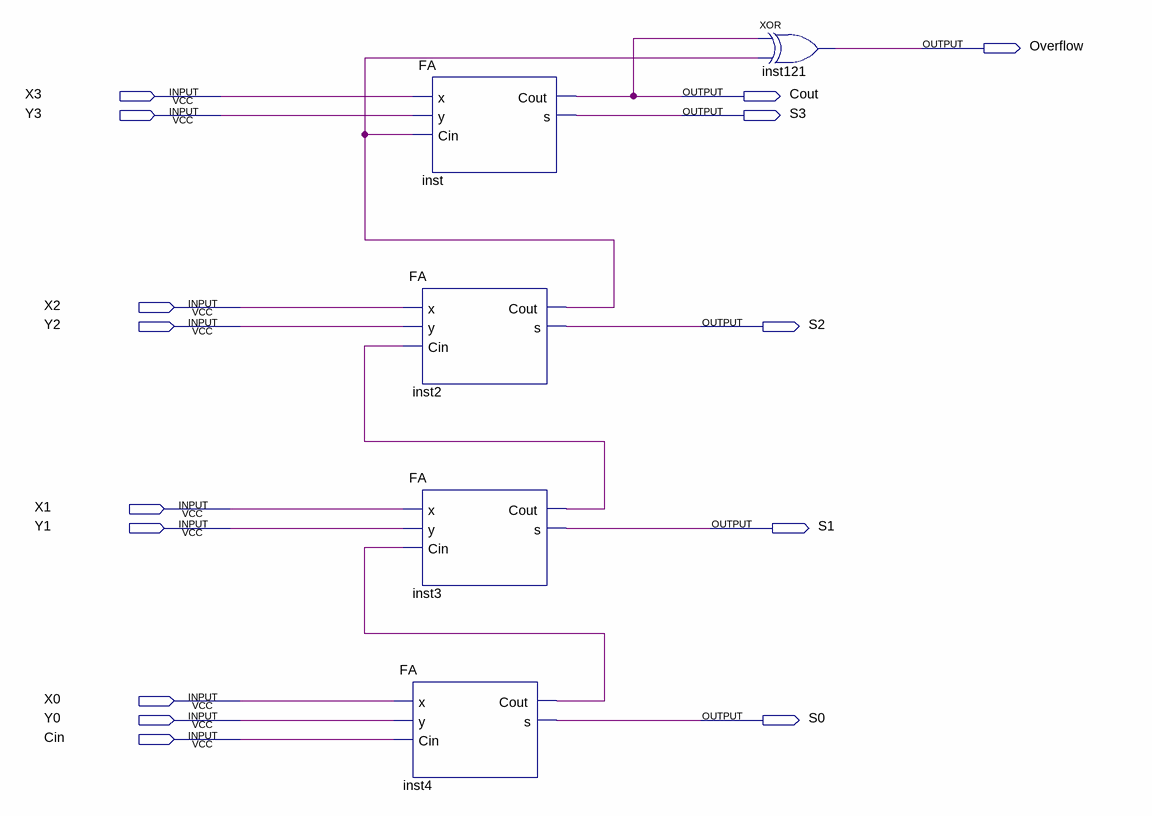
[diagram p0: schematic sheet]
// Quartus schematic 4_Bit_Carry_Adder.bdf as structural Verilog: 5 symbols, 15 pins
module \4_Bit_Carry_Adder  (
  input  X3,
  input  Y3,
  input  X2,
  input  Y2,
  input  X1,
  input  Y1,
  input  X0,
  input  Y0,
  input  Cin,
  output Overflow,
  output Cout,
  output S3,
  output S2,
  output S1,
  output S0
);

  wire inst2_cout, inst3_cout, inst4_cout;

  FA inst2 (.x(X2), .y(Y2), .Cin(inst3_cout), .Cout(inst2_cout), .s(S2));
  FA inst3 (.x(X1), .y(Y1), .Cin(inst4_cout), .Cout(inst3_cout), .s(S1));
  FA inst4 (.x(X0), .y(Y0), .Cin(Cin), .Cout(inst4_cout), .s(S0));
  FA inst (.x(X3), .y(Y3), .Cin(inst2_cout), .Cout(Cout), .s(S3));
  xor inst121 (Overflow, Cout, inst2_cout);
endmodule
